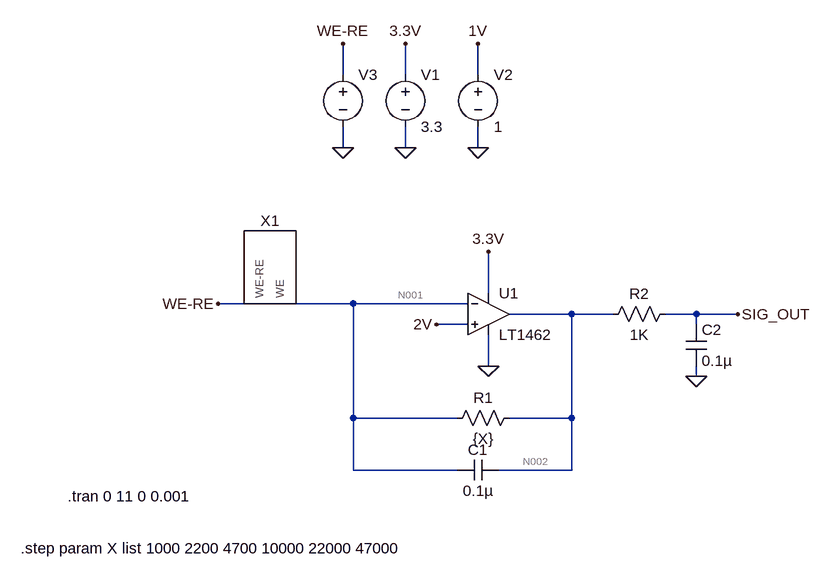
[diagram p0: schematic Trans Amp LT1462 Transient.asc]
Trans Amp LT1462 Transient.asc, the LTspice schematic file:
Version 4
SHEET 1 892 680
WIRE 160 -464 160 -512
WIRE 256 -464 256 -512
WIRE 368 -464 368 -512
WIRE 160 -352 160 -384
WIRE 256 -352 256 -384
WIRE 368 -352 368 -384
WIRE 384 -128 384 -192
WIRE 32 -112 -32 -112
WIRE 176 -112 64 -112
WIRE 352 -112 176 -112
WIRE 512 -96 416 -96
WIRE 576 -96 512 -96
WIRE 704 -96 656 -96
WIRE 768 -96 704 -96
WIRE 352 -80 304 -80
WIRE 704 -80 704 -96
WIRE 384 -16 384 -64
WIRE 704 0 704 -16
WIRE 176 64 176 -112
WIRE 336 64 176 64
WIRE 512 64 512 -96
WIRE 512 64 416 64
WIRE 176 144 176 64
WIRE 336 144 176 144
WIRE 512 144 512 64
WIRE 512 144 400 144
FLAG 256 -352 0
FLAG 368 -352 0
FLAG 368 -512 1V
FLAG 256 -512 3.3V
FLAG 384 -192 3.3V
FLAG 384 -16 0
FLAG 304 -80 2V
FLAG 704 0 0
FLAG 768 -96 SIG_OUT
FLAG 160 -352 0
FLAG 160 -512 WE-RE
FLAG -32 -112 WE-RE
SYMBOL voltage 256 -480 R0
WINDOW 123 0 0 Left 0
WINDOW 39 0 0 Left 0
SYMATTR InstName V1
SYMATTR Value 3.3
SYMBOL voltage 368 -480 R0
WINDOW 123 0 0 Left 0
WINDOW 39 0 0 Left 0
SYMATTR InstName V2
SYMATTR Value 1
SYMBOL OpAmps\\LT1462 384 -160 R0
SYMATTR InstName U1
SYMBOL res 432 48 R90
WINDOW 0 0 56 VBottom 2
WINDOW 3 32 56 VTop 2
SYMATTR InstName R1
SYMATTR Value {X}
SYMATTR SpiceLine tol=1 pwr=0.1
SYMBOL cap 400 128 R90
WINDOW 0 0 32 VBottom 2
WINDOW 3 32 32 VTop 2
SYMATTR InstName C1
SYMATTR Value 0.1µ
SYMATTR SpiceLine V=4 Irms=0 Rser=0 Lser=0 mfg="Murata" pn="GRM022R60G153KE15" type="X5R"
SYMBOL res 672 -112 R90
WINDOW 0 0 56 VBottom 2
WINDOW 3 32 56 VTop 2
SYMATTR InstName R2
SYMATTR Value 1K
SYMATTR SpiceLine tol=1 pwr=0.1
SYMBOL cap 688 -80 R0
SYMATTR InstName C2
SYMATTR Value 0.1µ
SYMATTR SpiceLine V=4 Irms=0 Rser=0 Lser=0 mfg="Murata" pn="GRM022R60G153KE15" type="X5R"
SYMBOL voltage 160 -480 R0
WINDOW 123 0 0 Left 0
WINDOW 39 0 0 Left 0
WINDOW 3 24 96 Invisible 2
SYMATTR InstName V3
SYMATTR Value PWL file=swv.txt
SYMBOL Randles_Circuit 48 -176 R90
WINDOW 0 -48 0 VBottom 2
SYMATTR InstName X1
TEXT -336 264 Left 2 !.step param X list 1000 2200 4700 10000 22000 47000
TEXT -264 184 Left 2 !.tran 0 11 0 0.001

The netlist it stands for:
* Trans Amp LT1462 Transient.asc
V1 3.3V 0 3.3
V2 1V 0 1
XU1 2V N001 3.3V 0 N002 LT1462  ; pins In+ In- V+ V- OUT
R1 N002 N001 {X} tol=1 pwr=0.1
C1 N002 N001 0.1µ V=4 Irms=0 Rser=0 Lser=0 mfg="Murata" pn="GRM022R60G153KE15" type="X5R"
R2 SIG_OUT N002 1K tol=1 pwr=0.1
C2 SIG_OUT 0 0.1µ V=4 Irms=0 Rser=0 Lser=0 mfg="Murata" pn="GRM022R60G153KE15" type="X5R"
V3 WE-RE 0 PWL file=swv.txt
XX1 N001 WE-RE Randles_Circuit  ; pins WE WE-RE
.step param X list 1000 2200 4700 10000 22000 47000
.tran 0 11 0 0.001
.lib LTC.lib
.backanno
.end

* Results of the author's LTspice run, read from the files saved beside the schematic
* Operating Point (first step), zero values left out:
*   x = 1 k
*   V(3.3v) = 3.3 V
*   V(1v) = 1 V
*   V(n001) = 1.399 V
*   V(2v) = 1.399 V
*   V(n002) = 1.425 V
*   V(sig_out) = 1.425 V
*   V(we-re) = -25 mV
*   I(R1) = 26.07 µA
*   I(V1) = -44.45 µA
*   I(V3) = 26.07 µA
*   Ix(u1:3) = 44.45 µA
*   Ix(u1:4) = -18.38 µA
*   Ix(u1:5) = -26.07 µA
*   Ix(x1:WE) = 26.07 µA
*   Ix(x1:WE-RE) = -26.07 µA